# Altium project PCB_Project.PrjPcb
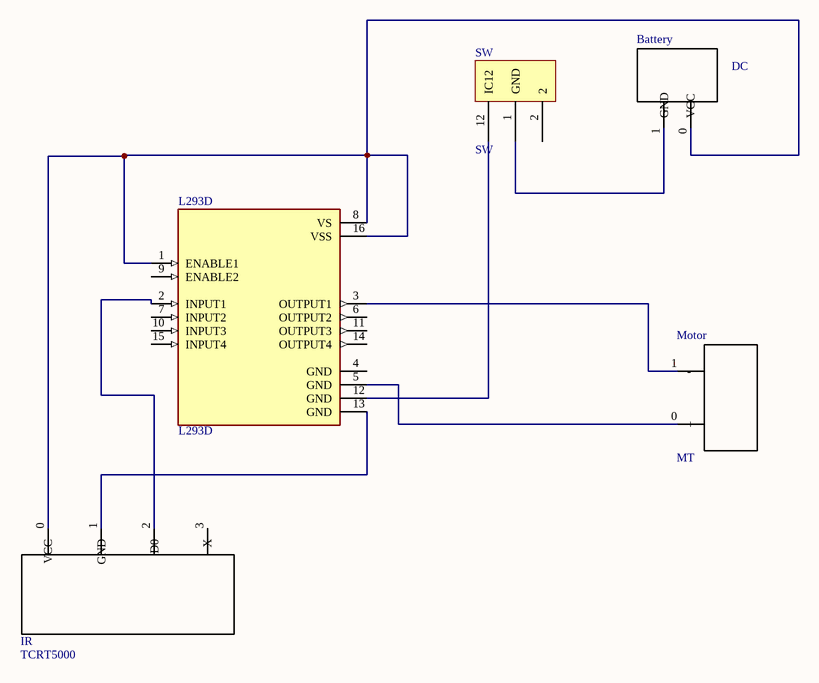
[diagram p0: Sheet1.SchDoc]
1 sheet, 5 parts. Net scope: global (net labels, ports and power ports of the same name join across sheets).
Board file: PCB1.PcbDoc

## Sheet Sheet1.SchDoc
size A4; SheetNumber: 1; SheetTotal: 1

### Parts
Battery  DC  [Battery]
IR  TCRT5000  [IR]
L293D  L293D  [DIP880W50P254L2000H510Q16]
Motor  MT  [motor]
SW  SW  [SW]

### Nets
NetBattery_0: Battery.0(VCC) IR.0(VCC) L293D.1(ENABLE1) L293D.8(VS) L293D.16(VSS)
NetBattery_1: Battery.1(GND) SW.1(GND)
NetIR_1: IR.1(GND) L293D.13(GND)
NetIR_2: IR.2(D0) L293D.2(INPUT1)
NetL293D_3: L293D.3(OUTPUT1) Motor.1(-)
NetL293D_5: L293D.5(GND) Motor.0(+)
NetL293D_12: L293D.12(GND) SW.12(IC12)

Not connected (* = marked no-connect by the designer): IR 3(X); L293D 4(GND) 6(OUTPUT2) 7(INPUT2) 9(ENABLE2) 10(INPUT3) 11(OUTPUT3) 14(OUTPUT4) 15(INPUT4); SW 2

### Library data of the parts
Battery = battery
L293D = L293D: Bipolar Motor Driver - Parallel 16-PowerDIP; MF: STMicroelectronics; MP: L293D; Package: DIP-16 STMicroelectronics; SnapEDA_Link: https://www.snapeda.com/parts/L293D/STMicroelectronics/view-part/?ref=snap; Purchase-URL: https://pricing.snapeda.com/search/part/L293D/?ref=eda; Check_prices: https://www.snapeda.com/parts/L293D/STMicroelectronics/view-part/?ref=eda; Availability: In Stock; Value: *; Price: None
Motor = motor